# EAGLE design atmegademo (EAGLE 6.4)
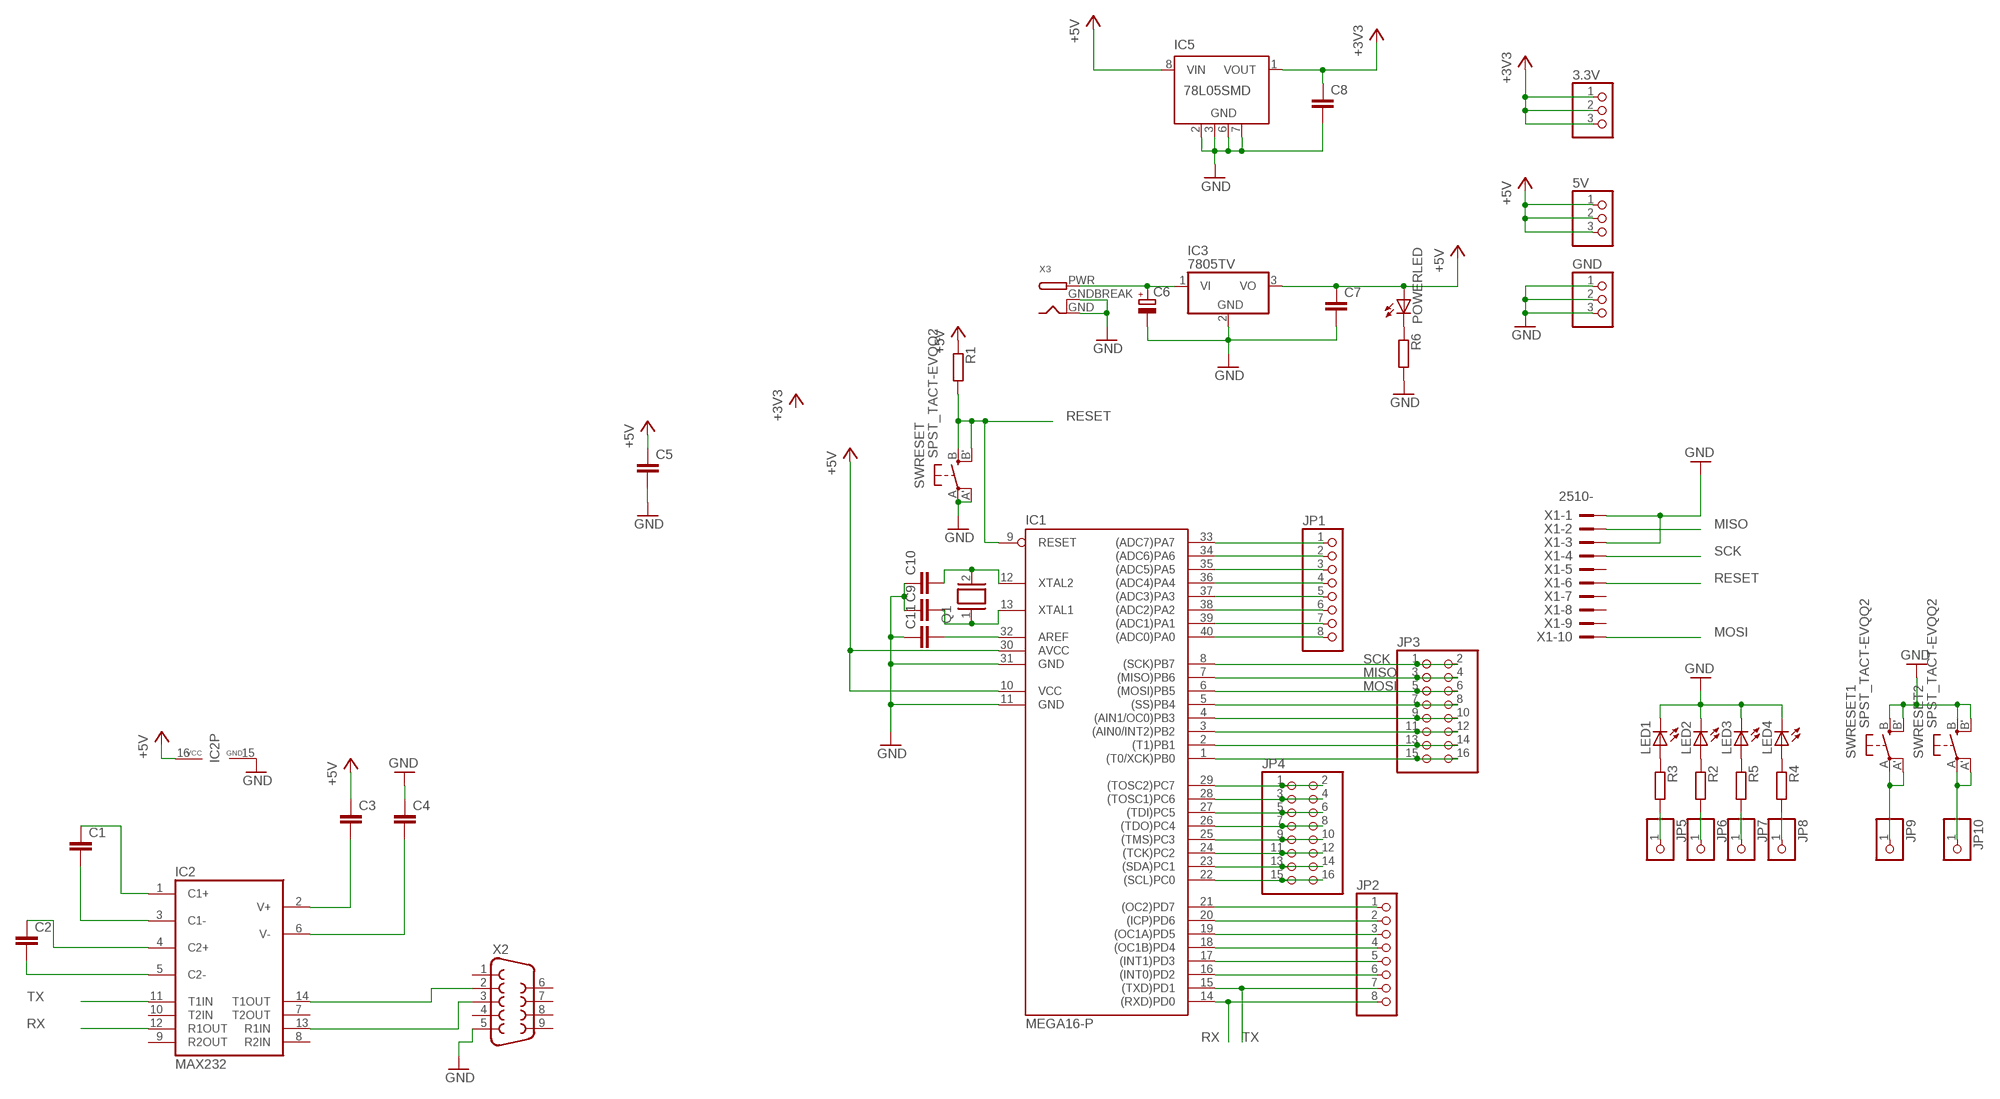
[diagram p0: schematic, sheet 1]

## Parts
3.3V  PINHD-1X3  [1X03]
5V  PINHD-1X3  [1X03]
C1  C-EUC0805K  [C0805K]
C2  C-EUC0805K  [C0805K]
C3  C-EUC0805K  [C0805K]
C4  C-EUC0805K  [C0805K]
C5  C-EUC0805K  [C0805K]
C6  CPOL-EUE2.5-5  [E2,5-5]
C7  C-EUC0805K  [C0805K]
C8  C-EUC0805K  [C0805K]
C9  C-EU050-025X075  [C050-025X075]
C10  C-EU050-025X075  [C050-025X075]
C11  C-EUC0805K  [C0805K]
GND  PINHD-1X3  [1X03]
IC1  MEGA16-P  [DIL40]
IC2  MAX232  [DIL16]
IC3  7805TV  [TO220V]
IC5  78L05SMD  [SO08]
JP1  PINHD-1X8BIG  [1X08-BIG]
JP2  PINHD-1X8BIG  [1X08-BIG]
JP3  PINHD-2X8  [2X08]
JP4  PINHD-2X8  [2X08]
JP5  PINHD-1X1  [1X01]
JP6  PINHD-1X1  [1X01]
JP7  PINHD-1X1  [1X01]
JP8  PINHD-1X1  [1X01]
JP9  PINHD-1X1  [1X01]
JP10  PINHD-1X1  [1X01]
LED1  LED3MM  [LED3MM]
LED2  LED3MM  [LED3MM]
LED3  LED3MM  [LED3MM]
LED4  LED3MM  [LED3MM]
POWERLED  LED3MM  [LED3MM]
Q1  XTAL/S  [QS]
R1  R-EU_0207/12  [0207/12]
R2  R-EU_R0805  [R0805]
R3  R-EU_M0805  [M0805]
R4  R-EU_R0805  [R0805]
R5  R-EU_M0805  [M0805]
R6  R-EU_M0805  [M0805]
SWRESET  SPST_TACT-EVQQ2  [EVQ-Q2]
SWRESET1  SPST_TACT-EVQQ2  [EVQ-Q2]
SWRESET2  SPST_TACT-EVQQ2  [EVQ-Q2]
X1  2510-  [PAK100/2500-10]
X2  F09H  [F09H]
X3  DCBARRELPTH  [DCJACK_2MM_PTH]

## Nets
+3V3: 3.3V.1 3.3V.2 3.3V.3 C8.1 IC5.1(VOUT)
+5V: 5V.1 5V.2 5V.3 C3.1 C5.1 C7.1 IC1.10(VCC) IC1.30(AVCC) IC2.16(VCC) IC3.3(VO) IC5.8(VIN) POWERLED.A R1.1
A0: IC1.40((ADC0)PA0) JP1.8
A1: IC1.39((ADC1)PA1) JP1.7
A2: IC1.38((ADC2)PA2) JP1.6
A3: IC1.37((ADC3)PA3) JP1.5
A4: IC1.36((ADC4)PA4) JP1.4
A5: IC1.35((ADC5)PA5) JP1.3
A6: IC1.34((ADC6)PA6) JP1.2
A7: IC1.33((ADC7)PA7) JP1.1
GND: C4.1 C5.2 C6.- C7.2 C8.2 C9.1 C10.1 C11.1 GND.1 GND.2 GND.3 IC1.11(GND) IC1.31(GND) IC2.15(GND) IC3.2(GND) IC5.2(GND) IC5.3(GND) IC5.6(GND) IC5.7(GND) LED1.K(C) LED2.K(C) LED3.K(C) LED4.K(C) R6.2 SWRESET1.B'(S1) SWRESET1.B(S) SWRESET2.B'(S1) SWRESET2.B(S) SWRESET.A'(P1) SWRESET.A(P) X1.1 X1.3 X2.5 X3.GND X3.GNDBREAK
MISO: IC1.7((MISO)PB6) JP3.3 JP3.4 X1.2
MOSI: IC1.6((MOSI)PB5) JP3.5 JP3.6 X1.10
N$1: C1.1 IC2.1(C1+)
N$2: C1.2 IC2.3(C1-)
N$3: C2.1 IC2.4(C2+)
N$4: C2.2 IC2.5(C2-)
N$5: C3.2 IC2.2(V+)
N$6: C4.2 IC2.6(V-)
N$7: IC1.21((OC2)PD7) JP2.1
N$8: IC2.13(R1IN) X2.3
N$9: IC2.14(T1OUT) X2.2
N$10: IC1.20((ICP)PD6) JP2.2
N$11: IC1.19((OC1A)PD5) JP2.3
N$12: IC1.18((OC1B)PD4) JP2.4
N$13: IC1.17((INT1)PD3) JP2.5
N$14: C6.+ IC3.1(VI) X3.PWR
N$15: IC1.16((INT0)PD2) JP2.6
N$16: IC1.4((AIN1/OC0)PB3) JP3.9 JP3.10
N$17: IC1.3((AIN0/INT2)PB2) JP3.11 JP3.12
N$18: IC1.2((T1)PB1) JP3.13 JP3.14
N$19: IC1.1((T0/XCK)PB0) JP3.15 JP3.16
N$20: IC1.29((TOSC2)PC7) JP4.1 JP4.2
N$21: IC1.28((TOSC1)PC6) JP4.3 JP4.4
N$22: IC1.5((SS)PB4) JP3.7 JP3.8
N$23: LED1.A R3.1
N$24: LED2.A R2.1
N$25: IC1.27((TDI)PC5) JP4.5 JP4.6
N$26: IC1.26((TDO)PC4) JP4.7 JP4.8
N$27: IC1.25((TMS)PC3) JP4.9 JP4.10
N$28: LED4.A R4.1
N$29: LED3.A R5.1
N$30: IC1.24((TCK)PC2) JP4.11 JP4.12
N$31: IC1.23((SDA)PC1) JP4.13 JP4.14
N$32: IC1.22((SCL)PC0) JP4.15 JP4.16
N$33: JP5.1 R3.2
N$34: JP6.1 R2.2
N$35: POWERLED.K(C) R6.1
N$36: JP7.1 R5.2
N$37: JP8.1 R4.2
N$38: C10.2 IC1.12(XTAL2) Q1.2
N$39: C9.2 IC1.13(XTAL1) Q1.1
N$40: JP9.1 SWRESET1.A'(P1) SWRESET1.A(P)
N$41: C11.2 IC1.32(AREF)
N$42: JP10.1 SWRESET2.A'(P1) SWRESET2.A(P)
RESET: IC1.9(RESET) R1.2 SWRESET.B'(S1) SWRESET.B(S) X1.6
RX: IC1.14((RXD)PD0) IC2.12(R1OUT) JP2.8
SCK: IC1.8((SCK)PB7) JP3.1 JP3.2 X1.4
TX: IC1.15((TXD)PD1) IC2.11(T1IN) JP2.7
Unconnected: IC2.7(T2OUT) IC2.8(R2IN) IC2.9(R2OUT) IC2.10(T2IN) IC5.4(NC) IC5.5(NC) X1.5 X1.7 X1.8 X1.9 X2.1 X2.4 X2.6 X2.7 X2.8 X2.9

## Library data of the parts
3.3V 5V GND = adafruit:PINHD-1X3: PIN HEADER
C1-C5 C7-C11 = resistor:C-EU: CAPACITOR, European symbol
C6 = resistor:CPOL-EU: POLARIZED CAPACITOR, European symbol
IC1 = atmel:MEGA16-P: MICROCONTROLLER 16 Kbytes FLASH 1 kbytes SRAM 512 bytes EEPROM USART 8-channel 10 bit ADC Source: avr.lbr; MPN: ATMEGA16-16PU; OC_FARNELL: 9171142; OC_NEWARK: 01M6885
IC2 = maxim:MAX232: RS232 TRANSEIVER; MF: MAXIM; MPN: MAX232ACPE+; OC_FARNELL: 9723773; OC_NEWARK: 68K4544
IC3 = linear:78*: Positive VOLTAGE REGULATOR Source: http://cache.national.com/ds/LM/LM78L05.pdf http://www.fairchildsemi.com/ds/LM/LM7805.pdf
IC5 = linear:78L*SMD: Positive VOLTAGE REGULATOR
JP1 JP2 = adafruit:PINHD-1X8: PIN HEADER
JP3 JP4 = pinhead:PINHD-2X8: PIN HEADER
JP5-JP10 = pinhead:PINHD-1X1: PIN HEADER
LED1-LED4 POWERLED = led:LED: LED OSRAM: - CHIPLED LG R971, LG N971, LY N971, LG Q971, LY Q971, LO R971, LY R971 LH N974, LH R974 LS Q976, LO Q976, LY Q976 LO Q996 - Hyper CHIPLED LW Q18S LB Q993, LB Q99A, LB R99A - SideLED LS A670, LO A670, LY A670, LG A670, LP A670 LB A673, LV A673, LT A673, LW A673 LH A674 LY A675 LS A676, LA A676, LO A676, LY A676, LW A676 LS A679, LY A679, LG A679 - Hyper Micro SIDELED® LS Y876, LA Y876, LO Y876, LY Y876 LT Y87S - SmartLED LW L88C, LW L88S LB L89C, LB L89S, LG L890 LS L89K, LO L89K, LY L89K LS L896, LA L896, LO L896, LY L896 - TOPLED LS T670, LO T670, LY T670, LG T670, LP T670 LSG T670, LSP T670, LSY T670, LOP T670, LYG T670 LG T671, LOG T671, LSG T671 LB T673, LV T673, LT T673, LW T673 LH T674 LS T676, LA T676, LO T676, LY T676, LB T676, LH T676, LSB T676, LW T676 LB T67C, LV T67C, LT T67C, LS T67K, LO T67K, LY T67K, LW E67C LS E67B, LA E67B, LO E67B, LY E67B, LB E67C, LV E67C, LT E67C LW T67C LS T679, LY T679, LG T679 LS T770, LO T770, LY T770, LG T770, LP T770 LB T773, LV T773, LT T773, LW T773 LH T774 LS E675, LA E675, LY E675, LS T675 LS T776, LA T776, LO T776, LY T776, LB T776 LHGB T686 LT T68C, LB T68C - Hyper Mini TOPLED® LB M676 - Mini TOPLED Santana® LG M470 LS M47K, LO M47K, LY M47K Source: http://www.osram.convergy.de LUXEON: - LUMILED® LXK2-PW12-R00, LXK2-PW12-S00, LXK2-PW14-U00, LXK2-PW14-V00 LXK2-PM12-R00, LXK2-PM12-S00, LXK2-PM14-U00 LXK2-PE12-Q00, LXK2-PE12-R00, LXK2-PE12-S00, LXK2-PE14-T00, LXK2-PE14-U00 LXK2-PB12-K00, LXK2-PB12-L00, LXK2-PB12-M00, LXK2-PB14-N00, LXK2-PB14-P00, LXK2-PB14-Q00 LXK2-PR12-L00, LXK2-PR12-M00, LXK2-PR14-Q00, LXK2-PR14-R00 LXK2-PD12-Q00, LXK2-PD12-R00, LXK2-PD12-S00 LXK2-PH12-R00, LXK2-PH12-S00 LXK2-PL12-P00, LXK2-PL12-Q00, LXK2-PL12-R00 Source: www.luxeon.com KINGBRIGHT: KA-3528ASYC Source: www.kingbright.com
Q1 = special:XTAL/S: CRYSTAL
R1-R6 = resistor:R-EU_: RESISTOR, European symbol
SWRESET SWRESET1 SWRESET2 = adafruit:SPST_TACT: SMT 6mm switch, EVQQ2 series http://www.ladyada.net/library/eagle
X1 = con-3m:2510-: 3M (TM) Pak 100 4-Wall Header Source: 3M; MF: 3M; MPN: 2510-6002UB; OC_FARNELL: 9838244; OC_NEWARK: 46F4725
X2 = con-subd:F09: SUB-D; OC_FARNELL: unknown; OC_NEWARK: unknown
X3 = adafruit:DCBARREL: 2.0mm DC Barrel Jack DCJACK_2MM_PTH - Through Hole Jack (4UConnector: 05537)

## Board
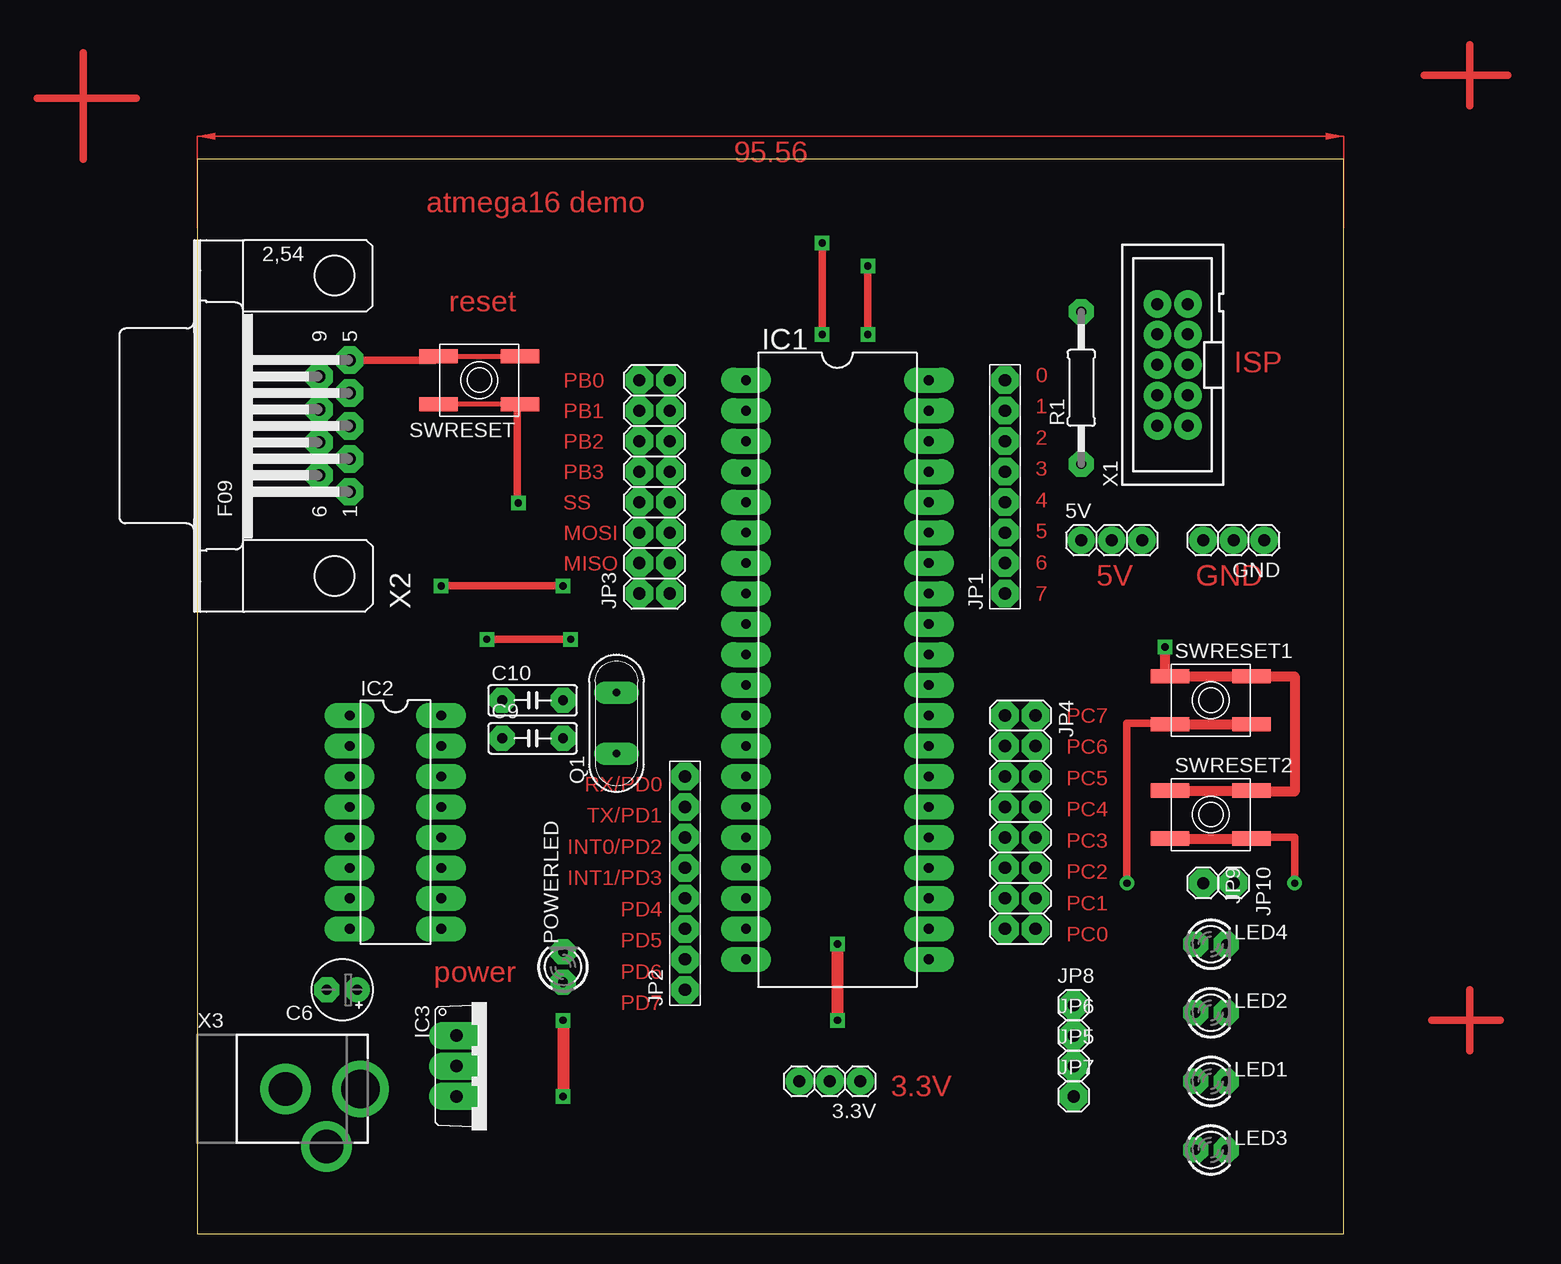
[diagram p1: board, top side]
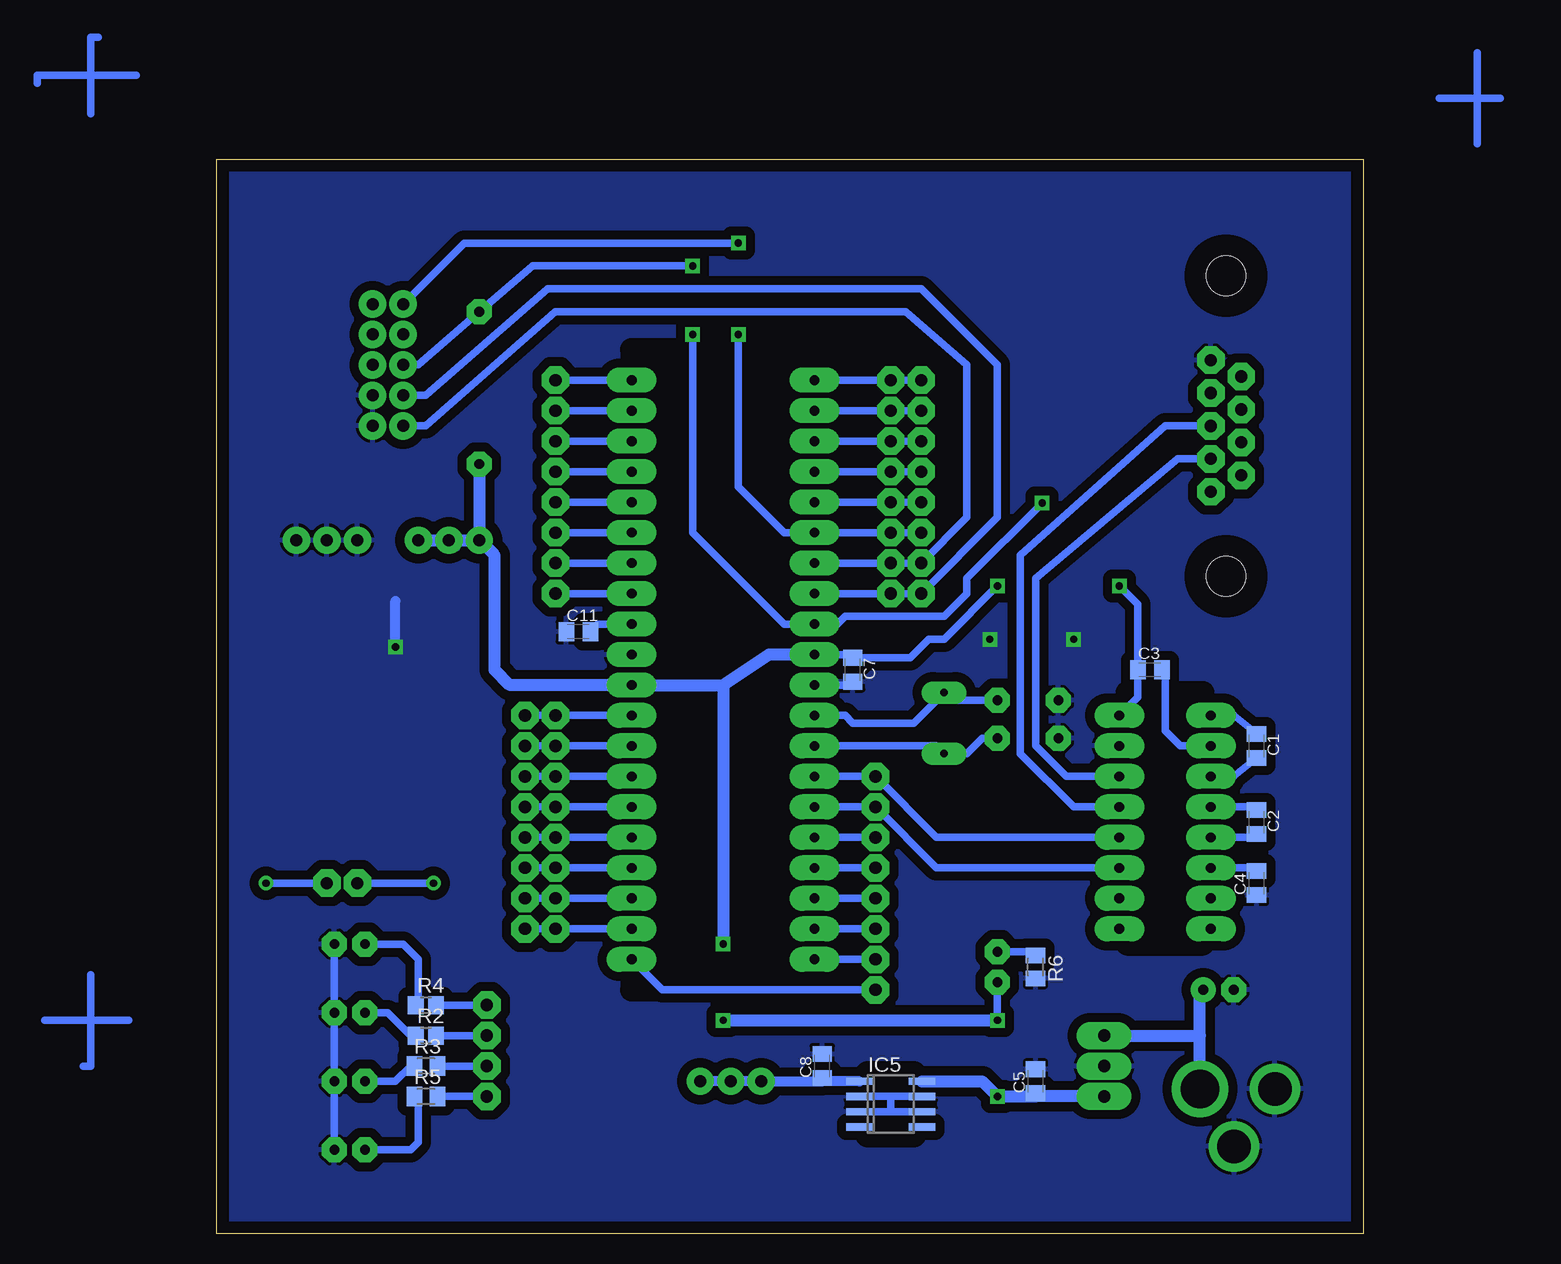
[diagram p2: board, bottom side, seen from below]

Size 95.56 x 89.53 mm. Coordinates in mm from the lower left corner, seen from the top.
Outline: 0,0 95.56,0 95.56,89.53 0,89.53 0,0
Copper layers (1*16): Top 0.035mm / dielectric 1.5mm / Bottom 0.035mm
Design rules "default": minimum track width 10mil, minimum drill 32mil, track to track 12mil, track to pad 12mil, pad to pad 12mil, via to via 12mil, smd to smd 8mil, copper to edge 40mil, drill to drill 40mil, minimum pad ring 25mil, minimum via ring 12mil, stop-mask expansion 4mil, vias tented up to drill 0mil, thermal gap 10mil
bRestrict: area 46.4,20.3 to 61,73.7; area 13.3,24.1 to 19.7,45.1; area 37.5,8.3 to 41.3,13.3

### Footprints (pad centres in the part's own frame; a part is rotated, then mirrored left to right if it is on the bottom)
1X03 = drill 1.016: 1 -2.54,0; 2 0,0; 3 2.54,0
C0805K = smd 1.3 x 1.6: 1 -1,0; 2 1,0
E2,5-5 = drill 0.813 pad 1.6: + -1.27,0 | drill 0.813 pad 1.6 octagon: - 1.27,0
C050-025X075 = drill 0.813 octagon: 1 -2.54,0; 2 2.54,0
DIL40 = drill 0.813 long: 1 -24.13,-7.62; 2 -21.59,-7.62; 3 -19.05,-7.62; 4 -16.51,-7.62; 5 -13.97,-7.62; 6 -11.43,-7.62; 7 -8.89,-7.62; 8 -6.35,-7.62; 9 -3.81,-7.62; 10 -1.27,-7.62; 11 1.27,-7.62; 12 3.81,-7.62; 13 6.35,-7.62; 14 8.89,-7.62; 15 11.43,-7.62; 16 13.97,-7.62; 17 16.51,-7.62; 18 19.05,-7.62; 19 21.59,-7.62; 20 24.13,-7.62; 21 24.13,7.62; 22 21.59,7.62; 23 19.05,7.62; 24 16.51,7.62; 25 13.97,7.62; 26 11.43,7.62; 27 8.89,7.62; 28 6.35,7.62; 29 3.81,7.62; 30 1.27,7.62; 31 -1.27,7.62; 32 -3.81,7.62; 33 -6.35,7.62; 34 -8.89,7.62; 35 -11.43,7.62; 36 -13.97,7.62; 37 -16.51,7.62; 38 -19.05,7.62; 39 -21.59,7.62; 40 -24.13,7.62
DIL16 = drill 0.813 long: 1 -8.89,-3.81; 2 -6.35,-3.81; 3 -3.81,-3.81; 4 -1.27,-3.81; 5 1.27,-3.81; 6 3.81,-3.81; 7 6.35,-3.81; 8 8.89,-3.81; 9 8.89,3.81; 10 6.35,3.81; 11 3.81,3.81; 12 1.27,3.81; 13 -1.27,3.81; 14 -3.81,3.81; 15 -6.35,3.81; 16 -8.89,3.81
TO220V = drill 1.016 long: 1 -2.54,-2.54; 2 0,-2.54; 3 2.54,-2.54
SO08 = smd 0.6 x 2.2: 1 -1.905,-2.6; 2 -0.635,-2.6; 3 0.635,-2.6; 4 1.905,-2.6; 5 1.905,2.6; 6 0.635,2.6; 7 -0.635,2.6; 8 -1.905,2.6
1X08-BIG = drill 1.016 pad 1.778 octagon: 1 -8.89,0; 2 -6.35,0; 3 -3.81,0; 4 -1.27,0; 5 1.27,0; 6 3.81,0; 7 6.35,0; 8 8.89,0
2X08 = drill 1.016 octagon: 1 -8.89,-1.27; 2 -8.89,1.27; 3 -6.35,-1.27; 4 -6.35,1.27; 5 -3.81,-1.27; 6 -3.81,1.27; 7 -1.27,-1.27; 8 -1.27,1.27; 9 1.27,-1.27; 10 1.27,1.27; 11 3.81,-1.27; 12 3.81,1.27; 13 6.35,-1.27; 14 6.35,1.27; 15 8.89,-1.27; 16 8.89,1.27
1X01 = drill 1.016 octagon: 1 0,0
LED3MM = drill 0.813 octagon: A -1.27,0; K 1.27,0
QS = drill 0.61 long: 1 -2.54,0; 2 2.54,0
0207/12 = drill 0.813 octagon: 1 -6.35,0; 2 6.35,0
R0805 = smd 1.3 x 1.5: 1 -0.85,0; 2 0.85,0
M0805 = smd 1.3 x 1.6: 1 -0.95,0; 2 0.95,0
EVQ-Q2 = smd 3.2 x 1.2: A -3.4,-2; A' 3.4,-2; B -3.4,2; B' 3.4,2
PAK100/2500-10 = drill 1 pad 1.422: 1 -5.08,-1.27; 2 -5.08,1.27; 3 -2.54,-1.27; 4 -2.54,1.27; 5 0,-1.27; 6 0,1.27; 7 2.54,-1.27; 8 2.54,1.27; 9 5.08,-1.27; 10 5.08,1.27
F09H = drill 1.016 octagon: 1 -5.486,-1.27; 2 -2.743,-1.27; 3 0,-1.27; 4 2.743,-1.27; 5 5.486,-1.27; 6 -4.115,1.27; 7 -1.372,1.27; 8 1.372,1.27; 9 4.115,1.27 | hole 3.302: -12.522,0; 12.522,0
DCJACK_2MM_PTH = drill 2.8: GND 0,7.35; GNDBREAK 4.8,10.75 | drill 3.2: PWR 0,13.6

### Placement (x,y rotation side)
3.3V  52.7,12.7 180 top
5V  76.2,57.79 0 top
C1  8.89,40.64 270 bottom
C2  8.89,34.29 270 bottom
C3  17.78,46.99 0 bottom
C4  8.89,29.21 90 bottom
C5  27.3,12.7 90 bottom
C6  12.06,20.32 180 top
C7  42.55,46.99 270 bottom
C8  45.09,13.97 90 bottom
C9  27.94,41.28 0 top
C10  27.94,44.45 0 top
C11  65.41,50.16 0 bottom
GND  86.36,57.79 180 top
IC1  53.34,46.99 270 top
IC2  16.51,34.29 270 top
IC3  24.13,13.97 270 top
IC5  39.37,10.79 270 bottom
JP1  67.31,62.23 90 top
JP2  40.64,29.21 90 top
JP3  38.1,62.23 90 top
JP4  68.58,34.29 270 top
JP5  73.03,13.97 0 top
JP6  73.03,16.51 0 top
JP7  73.03,11.43 0 top
JP8  73.03,19.05 0 top
JP9  83.82,29.21 270 top
JP10  86.36,29.21 270 top
LED1  84.45,12.7 0 top
LED2  84.45,18.41 0 top
LED3  84.45,6.98 0 top
LED4  84.45,24.13 0 top
POWERLED  30.48,22.22 90 top
Q1  34.92,42.55 90 top
R1  73.66,70.48 90 top
R2  78.11,16.51 0 bottom
R3  78.11,13.97 0 bottom
R4  78.11,19.05 0 bottom
R5  78.11,11.43 0 bottom
R6  27.3,22.22 270 bottom
SWRESET  23.5,71.12 180 top
SWRESET1  84.45,44.45 0 top
SWRESET2  84.45,34.92 0 top
X1  81.28,72.39 90 top
X2  11.43,67.31 90 top
X3  0,12.07 270 top

### Tracks (layer width: path | path; a pad name or v marks a point on that pad's centre or on a via)
+3V3
  Bottom 0.61: 45.09,12.7 C8.1
  Bottom 0.813: 3.3V.1 3.3V.2 3.3V.3 45.09,12.7 IC5.1
+5V  (via drill 0.6)
  Top 0.61: v20.32,53.98 v30.48,53.98
  Top 1.016: v53.34,24.13 v53.34,17.78 | v30.48,17.78 v30.48,11.43
  Bottom 0.61: 75.56,57.15 5V.2 | v20.32,53.98 18.78,52.44 C3.1 18.78,44.72 IC2.16 | IC1.10 42.81,48.26 C7.1 37.73,47.99 36.2,49.53 34.92,49.53 v30.48,53.98 | v30.48,17.78 POWERLED.A
  Bottom 1.016: IC1.10 49.53,48.26 53.34,45.72 | 53.34,45.72 IC1.30 71.12,45.72 72.39,46.99 72.39,56.52 5V.1 | 53.34,45.72 v53.34,24.13 | v53.34,17.78 v30.48,17.78 | 5V.3 5V.2 5V.1 | R1.1 5V.1 | IC5.8 31.75,12.7 v30.48,11.43 27.3,11.43 | IC3.3 27.3,11.43 | 27.3,11.43 C5.1
A0
  Bottom 0.61: IC1.40 JP1.8
A1
  Bottom 0.61: IC1.39 JP1.7
A2
  Bottom 0.61: IC1.38 JP1.6
A3
  Bottom 0.61: IC1.37 JP1.5
A4
  Bottom 0.61: IC1.36 JP1.4
A5
  Bottom 0.61: IC1.35 JP1.3
A6
  Bottom 0.61: IC1.34 JP1.2
A7
  Bottom 0.61: IC1.33 JP1.1
GND  (via drill 0.6)
  Top 0.406: SWRESET.A SWRESET.A' 19.77,72.8
  Top 0.61: v31.11,49.53 v24.13,49.53 | X2.5 19.77,72.8
  Top 0.813: SWRESET2.B SWRESET2.B' 87.86,36.83 91.44,36.83 91.44,46.45 SWRESET1.B' SWRESET1.B 80.64,46.45 v80.64,48.9
  Bottom 0.61: LED3.K LED1.K LED2.K LED4.K | IC1.11 42.81,45.72 C7.2 | IC5.7 39.37,11.43 | 39.37,11.43 IC5.2 | IC5.6 39.37,10.16 | 41.91,10.16 39.37,10.16 | 39.37,10.16 39.37,11.43
  Bottom 0.813: v80.64,48.9 80.64,52.71
  pour Bottom (isolate 0.762): -6.99,99.06 102.87,98.42 102.87,0 -6.99,0.64
MISO
  Bottom 0.61: IC1.7 JP3.3 JP3.4 33.02,59.69 33.02,72.39 38.1,76.84 67.31,76.84 78.11,67.31 X1.2
MOSI  (via drill 0.6)
  Top 0.61: v52.07,74.93 v52.07,82.55
  Bottom 0.61: JP3.6 JP3.5 IC1.6 48.26,58.42 52.07,62.23 v52.07,74.93 | v52.07,82.55 74.93,82.55 X1.10
N$1
  Bottom 0.61: IC2.1 10.79,43.18 C1.1
N$2
  Bottom 0.61: IC2.3 10.79,38.1 C1.2
N$3
  Bottom 0.61: IC2.4 8.89,35.56 C2.1
N$4
  Bottom 0.61: IC2.5 8.89,33.02 C2.2
N$5
  Bottom 0.61: IC2.2 15.24,40.64 16.51,41.91 16.51,46.72 C3.2
N$6
  Bottom 0.61: IC2.6 8.89,30.48 C4.2
N$7
  Bottom 0.61: JP2.1 58.42,20.32 IC1.21
N$8
  Bottom 0.61: X2.3 16.51,67.31 28.57,56.52 28.57,40.01 24.13,35.56 IC2.13
N$9
  Bottom 0.61: X2.2 15.44,64.57 27.3,54.61 27.3,40.64 24.77,38.1 IC2.14
N$10
  Bottom 0.61: IC1.20 JP2.2
N$11
  Bottom 0.61: IC1.19 JP2.3
N$12
  Bottom 0.61: IC1.18 JP2.4
N$13
  Bottom 0.61: IC1.17 JP2.5
N$14
  Bottom 1.016: X3.PWR 13.6,16.51 | 13.6,16.51 13.6,20.05 C6.+ | IC3.1 13.6,16.51
N$15
  Bottom 0.61: IC1.16 JP2.6
N$16
  Bottom 0.61: IC1.4 JP3.9 JP3.10
N$17
  Bottom 0.61: IC1.3 JP3.11 JP3.12
N$18
  Bottom 0.61: IC1.2 JP3.13 JP3.14
N$19
  Bottom 0.61: IC1.1 JP3.15 JP3.16
N$20
  Bottom 0.61: IC1.29 JP4.1 JP4.2
N$21
  Bottom 0.61: IC1.28 JP4.3 JP4.4
N$22
  Bottom 0.61: IC1.5 JP3.7 JP3.8
N$23
  Bottom 0.61: LED1.A 80.64,12.7 79.38,13.97 R3.1
N$24
  Bottom 0.61: LED2.A 81.28,18.41 79.38,16.51 R2.1
N$25
  Bottom 0.61: IC1.27 JP4.5 JP4.6
N$26
  Bottom 0.61: IC1.26 JP4.7 JP4.8
N$27
  Bottom 0.61: IC1.25 JP4.9 JP4.10
N$28
  Bottom 0.61: LED4.A 80.01,24.13 78.74,22.86 78.74,19.05 R4.1
N$29
  Bottom 0.61: LED3.A 79.38,6.98 78.74,7.62 78.74,11.43 R5.1
N$30
  Bottom 0.61: IC1.24 JP4.11 JP4.12
N$31
  Bottom 0.61: IC1.23 JP4.13 JP4.14
N$32
  Bottom 0.61: IC1.22 JP4.15 JP4.16
N$33
  Bottom 0.61: JP5.1 R3.2
N$34
  Bottom 0.61: JP6.1 R2.2
N$35
  Bottom 0.61: POWERLED.K 27.62,23.49 R6.1
N$36
  Bottom 0.61: JP7.1 R5.2
N$37
  Bottom 0.61: JP8.1 R4.2
N$38
  Bottom 0.61: IC1.12 43.18,43.18 42.55,42.55 37.47,42.55 Q1.2 34.29,44.45 C10.2
N$39
  Bottom 0.61: IC1.13 35.56,40.64 Q1.1 33.02,40.01 31.75,41.28 C9.2
N$40  (via drill 0.6)
  Top 0.61: SWRESET1.A 80.64,42.55 77.47,42.55 v77.47,29.21
  Top 0.813: SWRESET1.A SWRESET1.A'
  Bottom 0.61: JP9.1 v77.47,29.21
N$41
  Bottom 0.61: IC1.32 63.77,50.8 C11.2
N$42  (via drill 0.6)
  Top 0.61: SWRESET2.A' 88.27,33.02 91.44,33.02 v91.44,29.21
  Top 0.813: SWRESET2.A SWRESET2.A'
  Bottom 0.61: JP10.1 v91.44,29.21
N$43
  Bottom 0.61: -9.53,98.42 -9.53,90.81
N$44
  Bottom 0.61: -11.43,94.62 -6.35,94.62
N$45
  Bottom 0.61: 102.23,96.52 110.49,96.52 110.49,95.89
N$46
  Bottom 0.61: 105.41,99.7 106.05,99.7 106.05,93.34
N$47
  Bottom 0.61: 102.87,17.78 109.86,17.78
N$48
  Bottom 0.61: 106.68,13.97 106.05,13.97 106.05,21.59
N$49
  Top 0.61: -13.34,94.62 -5.08,94.62
N$50
  Top 0.61: -9.53,89.53 -9.53,98.42
N$51
  Top 0.61: 102.23,96.52 109.22,96.52
N$52
  Top 0.61: 106.05,99.06 106.05,93.98
N$53
  Top 0.61: 102.87,17.78 108.58,17.78
N$54
  Top 0.61: 106.05,15.24 106.05,20.32
RESET  (via drill 0.6)
  Top 0.406: SWRESET.B SWRESET.B'
  Top 0.61: v55.88,74.93 v55.88,80.64 | SWRESET.B 26.67,68.58 26.67,60.96 v26.75,60.88
  Bottom 0.61: v55.88,74.93 55.88,58.42 48.26,50.8 IC1.9 43.81,50.8 43.18,51.44 34.92,51.44 33.02,53.34 33.02,54.61 v26.75,60.88 | v55.88,80.64 69.22,80.64 R1.2 78.74,72.39 X1.6
RX
  Bottom 0.61: IC1.14 JP2.8 35.56,33.02 IC2.12
SCK
  Bottom 0.61: IC1.8 JP3.1 JP3.2 30.48,59.69 30.48,72.39 36.83,78.74 67.94,78.74 78.11,69.85 X1.4
TX
  Bottom 0.61: IC1.15 JP2.7 35.56,30.48 IC2.11
(copper drawn outside any net)
  shapes: Top area x1

### Text on the board
Top: atmega16 demo | reset | ISP | PB0 / PB1 / PB2 / PB3 / SS / MOSI / MISO | 5V | GND | 0 / 1 / 2 / 3 / 4 / 5 / 6 / 7 | PC7 / PC6 / PC5 / PC4 / PC3 / PC2 / PC1 / PC0 | RX/PD0 / TX/PD1 / INT0/PD2 / INT1/PD3 / PD4 / PD5 / PD6 / PD7 | power | 3.3V